# EAGLE design z80sim_pio_3_route_b (EAGLE 9.6.2)

## Sheet 1 of 2
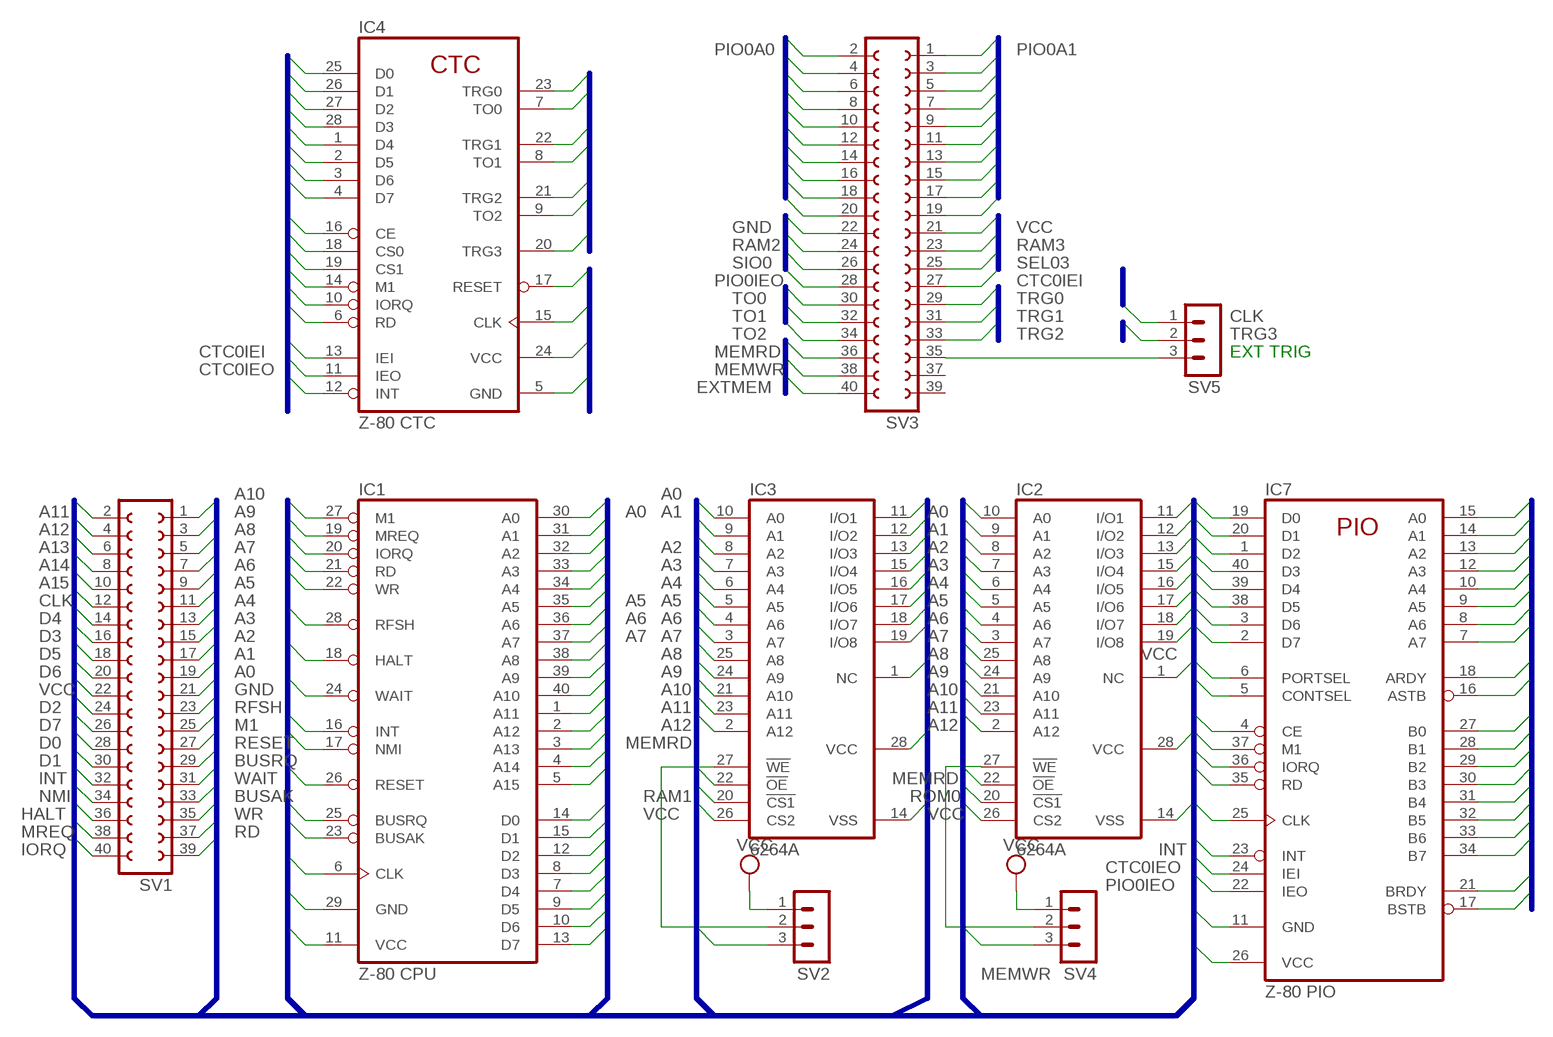
[diagram p0: schematic, sheet 1]

### Parts
IC1  Z-80 CPU  Z80CPU  [DIL40]
IC2  6264A  [DIL28-6]
IC3  6264A  [DIL28-6]
IC4  Z-80 CTC  Z80CTC  [DIL28]
IC7  Z-80 PIO  Z80PIO  [DIL40]
SV1  FE20-2  [FE20-2]
SV2  MA03-1  [MA03-1]
SV3  FE20-2  [FE20-2]
SV4  MA03-1  [MA03-1]
SV5  MA03-1  [MA03-1]

### Nets
A0: IC1.30(A0) IC2.10(A0) IC3.10(A0) IC4.18(CS0) IC7.6(PORTSEL) SV1.21
A1: IC1.31(A1) IC2.9(A1) IC3.9(A1) IC4.19(CS1) IC7.5(CONTSEL) SV1.19
A2: IC1.32(A2) IC2.8(A2) IC3.8(A2) SV1.17
A3: IC1.33(A3) IC2.7(A3) IC3.7(A3) SV1.15
A4: IC1.34(A4) IC2.6(A4) IC3.6(A4) SV1.13
A5: IC1.35(A5) IC2.5(A5) IC3.5(A5) SV1.11 ; also sheet 2
A6: IC1.36(A6) IC2.4(A6) IC3.4(A6) SV1.9 ; also sheet 2
A7: IC1.37(A7) IC2.3(A7) IC3.3(A7) SV1.7 ; also sheet 2
A8: IC1.38(A8) IC2.25(A8) IC3.25(A8) SV1.5
A9: IC1.39(A9) IC2.24(A9) IC3.24(A9) SV1.3
A10: IC1.40(A10) IC2.21(A10) IC3.21(A10) SV1.1
A11: IC1.1(A11) IC2.23(A11) IC3.23(A11) SV1.2
A12: IC1.2(A12) IC2.2(A12) IC3.2(A12) SV1.4
A13: IC1.3(A13) SV1.6 ; also sheet 2
A14: IC1.4(A14) SV1.8 ; also sheet 2
A15: IC1.5(A15) SV1.10 ; also sheet 2
BUSAK: IC1.23(BUSAK) SV1.35
BUSRQ: IC1.25(BUSRQ) SV1.31 ; also sheet 2
CLK: IC1.6(CLK) IC4.15(CLK) IC7.25(CLK) SV1.12 SV5.1 ; also sheet 2
CTC0: IC4.16(CE) ; also sheet 2
CTC0IEI: IC4.13(IEI) SV3.27 ; also sheet 2
CTC0IEO: IC4.11(IEO) IC7.24(IEI)
D0: IC1.14(D0) IC2.11(I/O1) IC3.11(I/O1) IC4.25(D0) IC7.19(D0) SV1.28
D1: IC1.15(D1) IC2.12(I/O2) IC3.12(I/O2) IC4.26(D1) IC7.20(D1) SV1.30
D2: IC1.12(D2) IC2.13(I/O3) IC3.13(I/O3) IC4.27(D2) IC7.1(D2) SV1.24
D3: IC1.8(D3) IC2.15(I/O4) IC3.15(I/O4) IC4.28(D3) IC7.40(D3) SV1.16
D4: IC1.7(D4) IC2.16(I/O5) IC3.16(I/O5) IC4.1(D4) IC7.39(D4) SV1.14
D5: IC1.9(D5) IC2.17(I/O6) IC3.17(I/O6) IC4.2(D5) IC7.38(D5) SV1.18
D6: IC1.10(D6) IC2.18(I/O7) IC3.18(I/O7) IC4.3(D6) IC7.3(D6) SV1.20
D7: IC1.13(D7) IC2.19(I/O8) IC3.19(I/O8) IC4.4(D7) IC7.2(D7) SV1.26
EXTMEM: SV3.40 ; also sheet 2
GND: IC1.29(GND) IC2.14(VSS) IC3.14(VSS) IC4.5(GND) IC7.11(GND) SV1.23 SV3.22 ; also sheet 2
HALT: IC1.18(HALT) SV1.36
INT: IC1.16(INT) IC4.12(INT) IC7.23(INT) SV1.32 ; also sheet 2
IORQ: IC1.20(IORQ) IC4.10(IORQ) IC7.36(IORQ) SV1.40 ; also sheet 2
M1: IC1.27(M1) IC4.14(M1) IC7.37(M1) SV1.27
MEMRD: IC2.22(!OE) IC3.22(!OE) SV3.36 ; also sheet 2
MEMWR: SV2.3 SV3.38 SV4.3 ; also sheet 2
MREQ: IC1.19(MREQ) SV1.38 ; also sheet 2
N$3: IC2.27(!WE) SV4.2
N$4: SV3.35 SV5.3
N$5: IC3.27(!WE) SV2.2
NMI: IC1.17(NMI) SV1.34 ; also sheet 2
PIO0: IC7.4(CE) ; also sheet 2
PIO0A0: IC7.15(A0) SV3.2
PIO0A1: IC7.14(A1) SV3.1
PIO0A2: IC7.13(A2) SV3.4
PIO0A3: IC7.12(A3) SV3.3
PIO0A4: IC7.10(A4) SV3.6
PIO0A5: IC7.9(A5) SV3.5
PIO0A6: IC7.8(A6) SV3.8
PIO0A7: IC7.7(A7) SV3.7
PIO0ARDY: IC7.18(ARDY) SV3.10
PIO0ASTB: IC7.16(ASTB) SV3.9
PIO0B0: IC7.27(B0) SV3.12
PIO0B1: IC7.28(B1) SV3.11
PIO0B2: IC7.29(B2) SV3.14
PIO0B3: IC7.30(B3) SV3.13
PIO0B4: IC7.31(B4) SV3.16
PIO0B5: IC7.32(B5) SV3.15
PIO0B6: IC7.33(B6) SV3.18
PIO0B7: IC7.34(B7) SV3.17
PIO0BRDY: IC7.21(BRDY) SV3.20
PIO0BSTB: IC7.17(BSTB) SV3.19
PIO0IEO: IC7.22(IEO) SV3.28
RAM1: IC3.20(!CS1) ; also sheet 2
RAM2: SV3.24 ; also sheet 2
RAM3: SV3.23 ; also sheet 2
RD: IC1.21(RD) IC4.6(RD) IC7.35(RD) SV1.39 ; also sheet 2
RESET: IC1.26(RESET) IC4.17(RESET) SV1.29 ; also sheet 2
RFSH: IC1.28(RFSH) SV1.25
ROM0: IC2.20(!CS1) ; also sheet 2
SEL03: SV3.25 ; also sheet 2
SIO0: SV3.26 ; also sheet 2
TO0: IC4.7(TO0) SV3.30
TO1: IC4.8(TO1) SV3.32
TO2: IC4.9(TO2) SV3.34
TRG0: IC4.23(TRG0) SV3.29
TRG1: IC4.22(TRG1) SV3.31
TRG2: IC4.21(TRG2) SV3.33
TRG3: IC4.20(TRG3) SV5.2
VCC: IC1.11(VCC) IC2.1(NC) IC2.26(CS2) IC2.28(VCC) IC3.1(NC) IC3.26(CS2) IC3.28(VCC) IC4.24(VCC) IC7.26(VCC) SV1.22 SV2.1 SV3.21 SV4.1 ; also sheet 2
WAIT: IC1.24(WAIT) SV1.33 ; also sheet 2
WR: IC1.22(WR) SV1.37 ; also sheet 2
Unconnected: SV3.37 SV3.39

### Buses
M1,MREQ,IORQ,RD,WR,RFSH,HALT,WAIT,INT,NMI,RESET,BUSRQ,BUSAK,CLK,GND,VCC,A[0..15],D[0..7],MEMRD,MEMWR,IORD,IOWR,ROM0,RAM1,RAM2,RAM3,PIO0,CTC0,CTC0IEO,PIO0IEO,SIO0,SIO0IEO,SEL03
PIO0A0,PIO0A1,PIO0A2,PIO0A3,PIO0A4,PIO0A5,PIO0A6,PIO0A7,PIO0B0,PIO0B1,PIO0B2,PIO0B3,PIO0B4,PIO0B5,PIO0B6,PIO0B7,PIO0ARDY,PIO0ASTB,PIO0BRDY,PIO0BSTB,PIO0ARDY,PIO0ASTB,PIO0BRDY,PIO0BSTB,CTC0TRG0,CTC0TO0,CTC0TRG1,CTC0TO1,CTC0TRG2,CTC0TO2,CTC0TRG3
M1,MREQ,IORQ,RD,WR,RFSH,HALT,WAIT,INT,NMI,RESET,BUSRQ,BUSAK,CLK,GND,VCC,A[0..15],D[0..7],MEMRD,MEMWR,IORD,IOWR,ROM0,RAM1,RAM2,RAM3,PIO0,CTC0,CTC0IEO,CTC0IEI,PIO0IEO,SIO0,SEL03,EXTMEM
TRG0,TO0,TRG1,TO1,TRG2,TO2,TRG3

### Notes on the sheet
- EXT TRIG

## Sheet 2 of 2
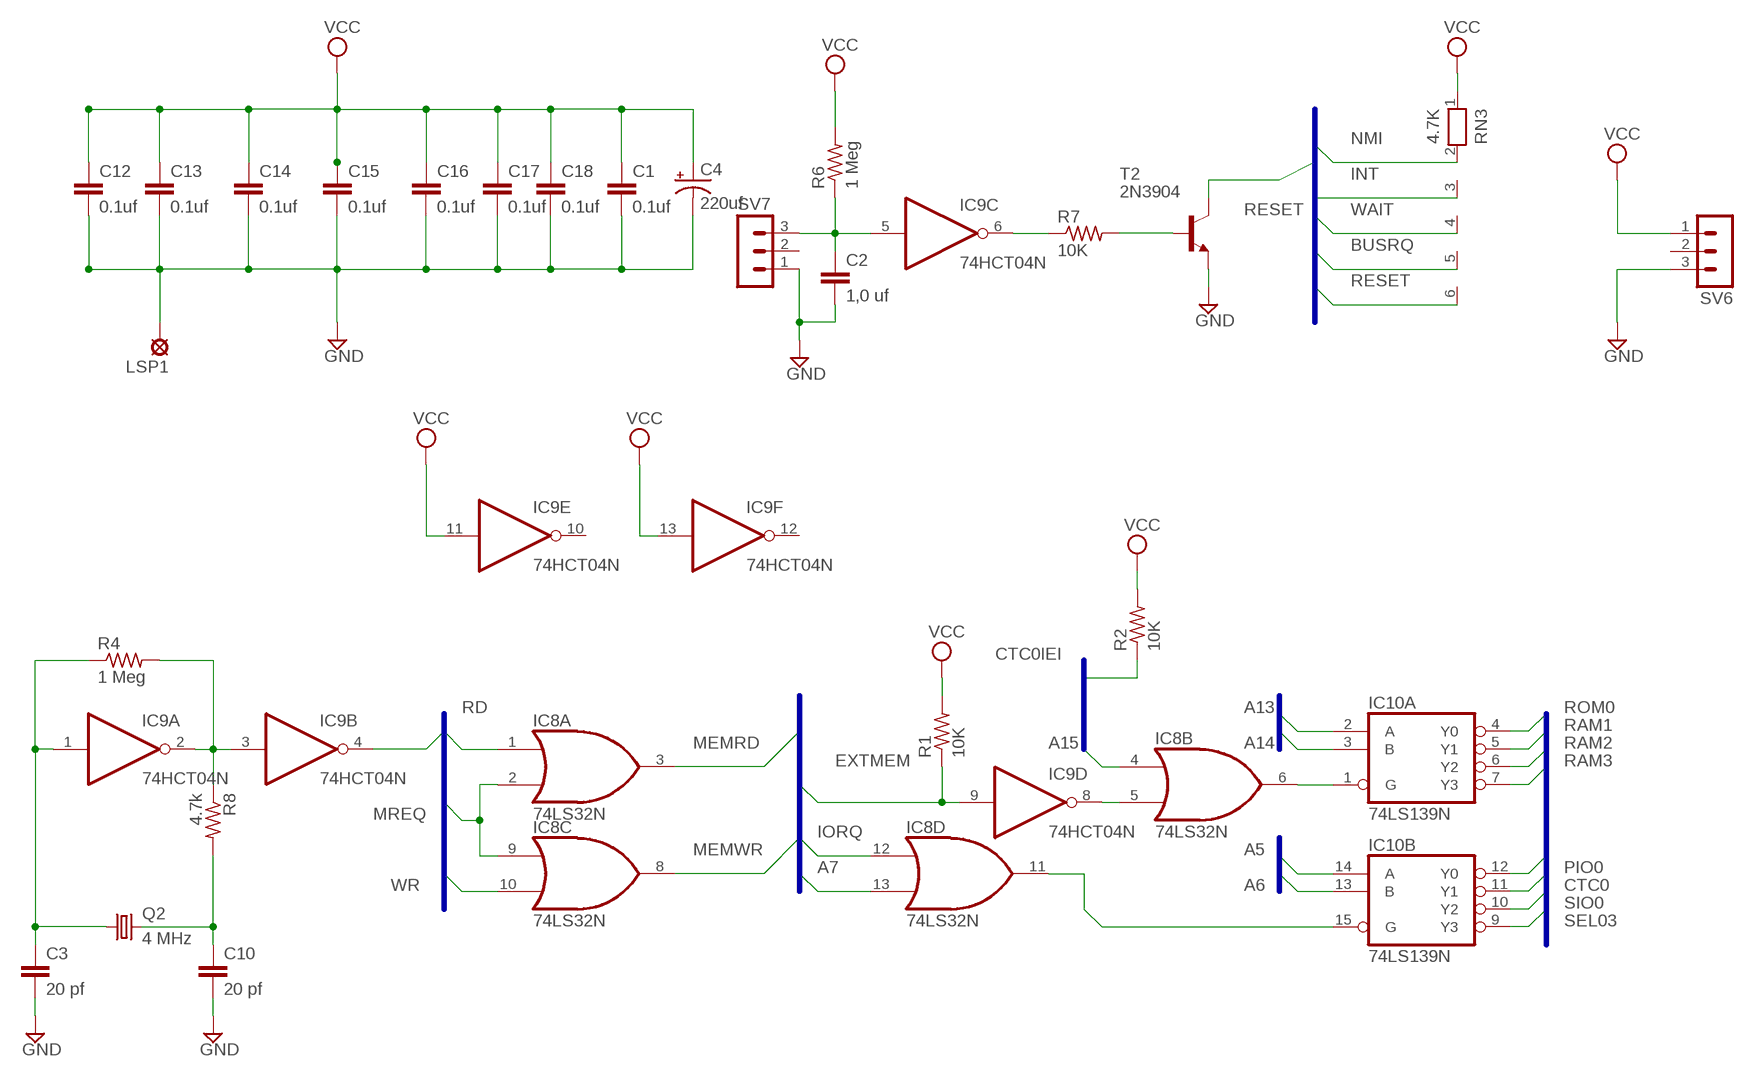
[diagram p1: schematic, sheet 2]

### Parts
C1  0.1uf  C5/3  [C5B3]
C2  1,0 uf  C5/3  [C5B3]
C3  20 pf  C2.5/5  [C2.5-5]
C4  220uf  CPOL-USE3.5-10  [E3,5-10]
C10  20 pf  C2.5/5  [C2.5-5]
C12  0.1uf  C5/3  [C5B3]
C13  0.1uf  C5/3  [C5B3]
C14  0.1uf  C5/3  [C5B3]
C15  0.1uf  C5/3  [C5B3]
C16  0.1uf  C5/3  [C5B3]
C17  0.1uf  C5/3  [C5B3]
C18  0.1uf  C5/3  [C5B3]
IC8  74LS32N  [DIL14]
IC9  74HCT04N  [DIL14]
IC10  74LS139N  [DIL16]
LSP1  LSP13  [LSP13]
Q2  4 MHz  CRYSTALHC49S  [HC49/S]
R1  10K  R-US_0204/7  [0204/7]
R2  10K  R-US_0204/7  [0204/7]
R4  1 Meg  R-US_0204/7  [0204/7]
R6  1 Meg  R-US_0204/7  [0204/7]
R7  10K  R-US_0204/7  [0204/7]
R8  4.7k  R-US_0204/7  [0204/7]
RN3  4.7K  RN05  [RN-6]
SV6  MA03-1  [MA03-1]
SV7  MA03-1  [MA03-1]
T2  2N3904  [TO92]

### Nets
A5: IC10.14(B:A) ; also sheet 1
A6: IC10.13(B:B) ; also sheet 1
A7: IC8.13(D:I1) ; also sheet 1
A13: IC10.2(A:A) ; also sheet 1
A14: IC10.3(A:B) ; also sheet 1
A15: IC8.4(B:I0) ; also sheet 1
BUSRQ: RN3.5 ; also sheet 1
CLK: IC9.4(B:O) ; also sheet 1
CTC0: IC10.11(B:Y1) ; also sheet 1
CTC0IEI: R2.1 ; also sheet 1
EXTMEM: IC9.9(D:I) R1.1 ; also sheet 1
GND: C1.2 C2.2 C3.2 C4.- C10.2 C12.2 C13.2 C14.2 C15.2 C16.2 C17.2 C18.2 LSP1.MP SV6.3 SV7.1 T2.3(E) ; also sheet 1
INT: RN3.2 ; also sheet 1
IORQ: IC8.12(D:I0) ; also sheet 1
MEMRD: IC8.3(A:O) ; also sheet 1
MEMWR: IC8.8(C:O) ; also sheet 1
MREQ: IC8.2(A:I1) IC8.9(C:I0) ; also sheet 1
N$1: IC8.6(B:O) IC10.1(A:G)
N$2: IC8.5(B:I1) IC9.8(D:O)
N$6: C10.1 Q2.2 R8.2
N$7: C3.1 IC9.1(A:I) Q2.1 R4.1
N$8: IC9.2(A:O) IC9.3(B:I) R4.2 R8.1
N$9: IC9.6(C:O) R7.1
N$10: C2.1 IC9.5(C:I) R6.1 SV7.3
N$11: R7.2 T2.2(B)
N$13: IC8.11(D:O) IC10.15(B:G)
NMI: RN3.3 ; also sheet 1
PIO0: IC10.12(B:Y0) ; also sheet 1
RAM1: IC10.5(A:Y1) ; also sheet 1
RAM2: IC10.6(A:Y2) ; also sheet 1
RAM3: IC10.7(A:Y3) ; also sheet 1
RD: IC8.1(A:I0) ; also sheet 1
RESET: RN3.6 T2.1(C) ; also sheet 1
ROM0: IC10.4(A:Y0) ; also sheet 1
SEL03: IC10.9(B:Y3) ; also sheet 1
SIO0: IC10.10(B:Y2) ; also sheet 1
VCC: C1.1 C4.+ C12.1 C13.1 C14.1 C15.1 C16.1 C17.1 C18.1 IC9.11(E:I) IC9.13(F:I) R1.2 R2.2 R6.2 RN3.1 SV6.1 ; also sheet 1
WAIT: RN3.4 ; also sheet 1
WR: IC8.10(C:I1) ; also sheet 1
Unconnected: IC9.10(E:O) IC9.12(F:O) SV6.2 SV7.2

### Buses
M1,MREQ,IORQ,RD,WR,RFSH,HALT,WAIT,INT,NMI,RESET,BUSRQ,BUSAK,CLK,GND,VCC,A[0..15],D[0..7],MEMRD,MEMWR,IORD,IOWR,ROM0,RAM1,RAM2,RAM3,PIO0,CTC0,CTC0IEO,PIO0IEO,SIO0,SIO0IEO,SEL03,EXTMEM
M1,MREQ,IORQ,RD,WR,RFSH,HALT,WAIT,INT,NMI,RESET,BUSRQ,BUSAK,CLK,GND,VCC,A[0..15],D[0..7],MEMRD,MEMWR,IORD,IOWR,ROM0,RAM1,RAM2,RAM3,PIO0,CTC0,CTC0IEO,CTC0IEI,PIO0IEO,SIO0,SEL03,EXTMEM

## Power pins joined to a net without a drawn wire
GND: IC8.7(P:GND) IC9.7(P:GND) IC10.8(P:GND)
VCC: IC8.14(P:VCC) IC9.14(P:VCC) IC10.16(P:VCC)

## Library data of the parts
C1-C3 C10 C12-C18 = capacitor-wima:C: CAPACITOR naming: grid - package width
C4 = rcl:CPOL-US: POLARIZED CAPACITOR, American symbol
IC1 = zilog:Z80CPU: Z80 FAMILY DEVICE
IC2 IC3 = memory-hitachi:6264A: MEMORY; OC_FARNELL: 283605; OC_NEWARK: unknown
IC4 = zilog:Z80CTC: Z80 FAMILY DEVICE
IC7 = zilog:Z80PIO: Z80 FAMILY DEVICE
IC8 = 74xx-us:74*32: Quad 2-input OR gate
IC9 = 74xx-eu:74*04: Hex INVERTER
IC10 = 74xx-us:74*139: Dual 2-line to 4-line DECODER/DEMULTIPLEXER
LSP1 = solpad:LSP13: SOLDER PAD drill 1.3 mm, distributor Buerklin, 12H562
Q2 = crystal:CRYSTAL: CRYSTAL; OC_FARNELL: 1667008; OC_NEWARK: unknown
R1 R2 R4 R6-R8 = resistor:R-US_: RESISTOR, American symbol
RN3 = resistor-net:RN05: RESISTOR NETWORK; OC_FARNELL: unknown; OC_NEWARK: unknown
SV1 SV3 = con-lsta:FE20-2: FEMALE HEADER; OC_FARNELL: unknown; OC_NEWARK: unknown
SV2 SV4-SV7 = con-lstb:MA03-1: PIN HEADER; OC_FARNELL: unknown; OC_NEWARK: unknown
T2 = transistor:2N3904: NPN TRANSISTOR

## Board
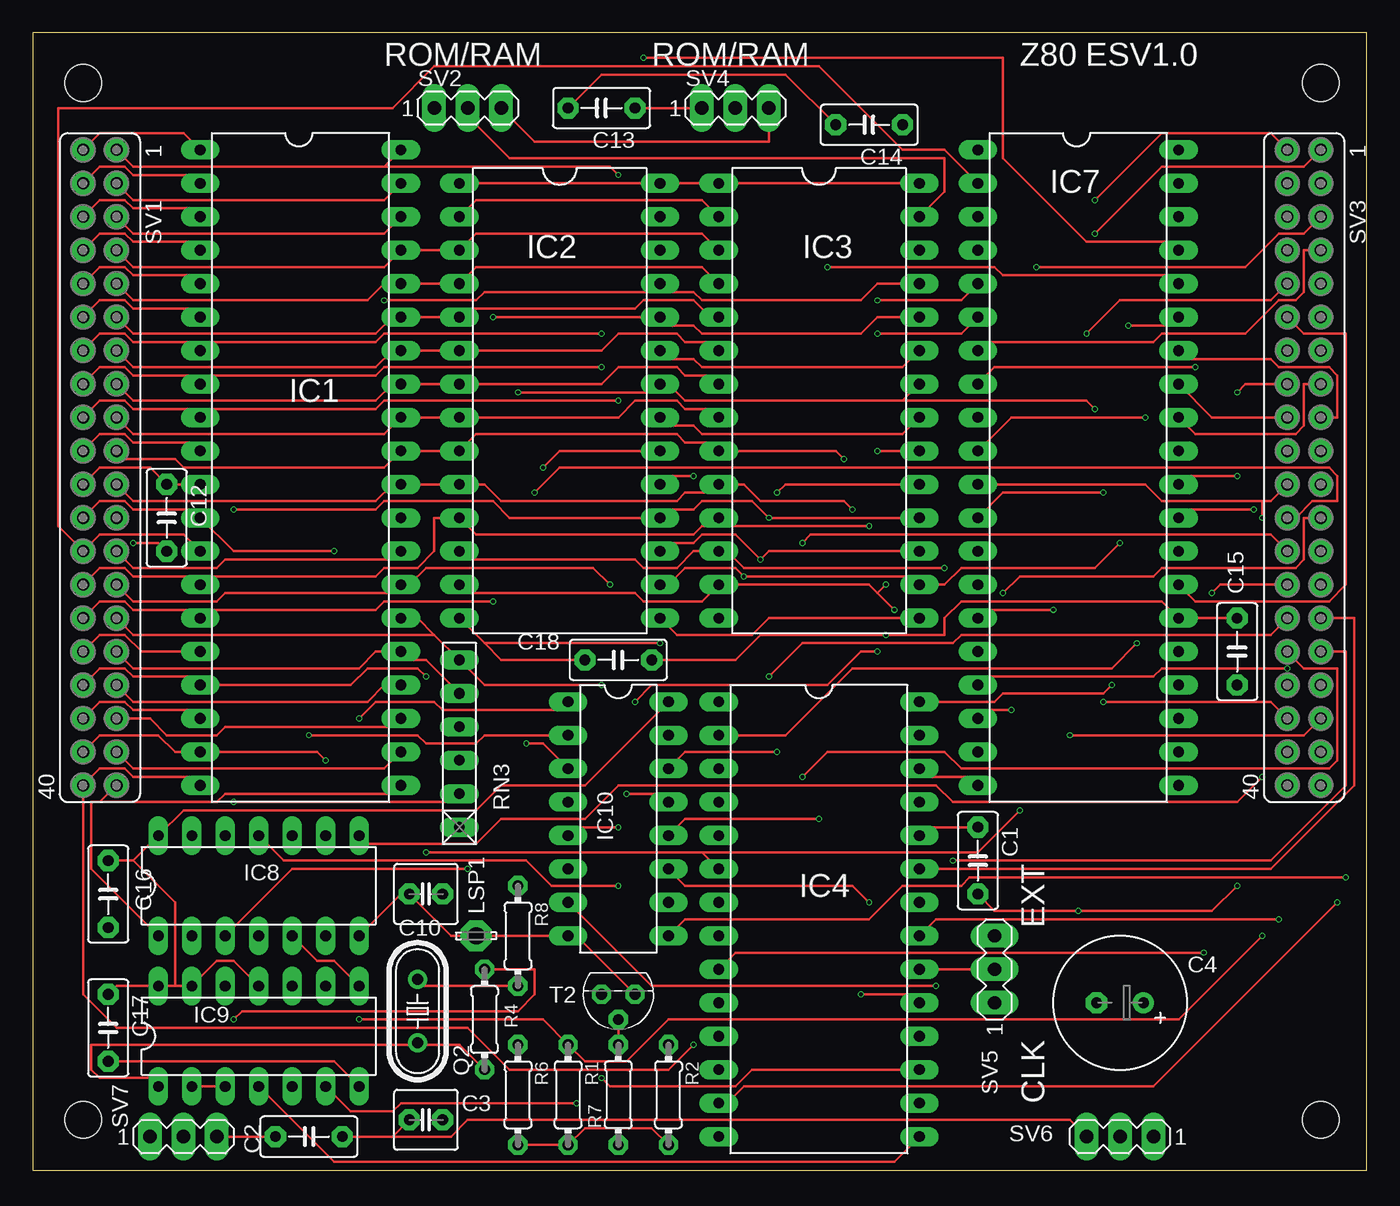
[diagram p2: board, top side]
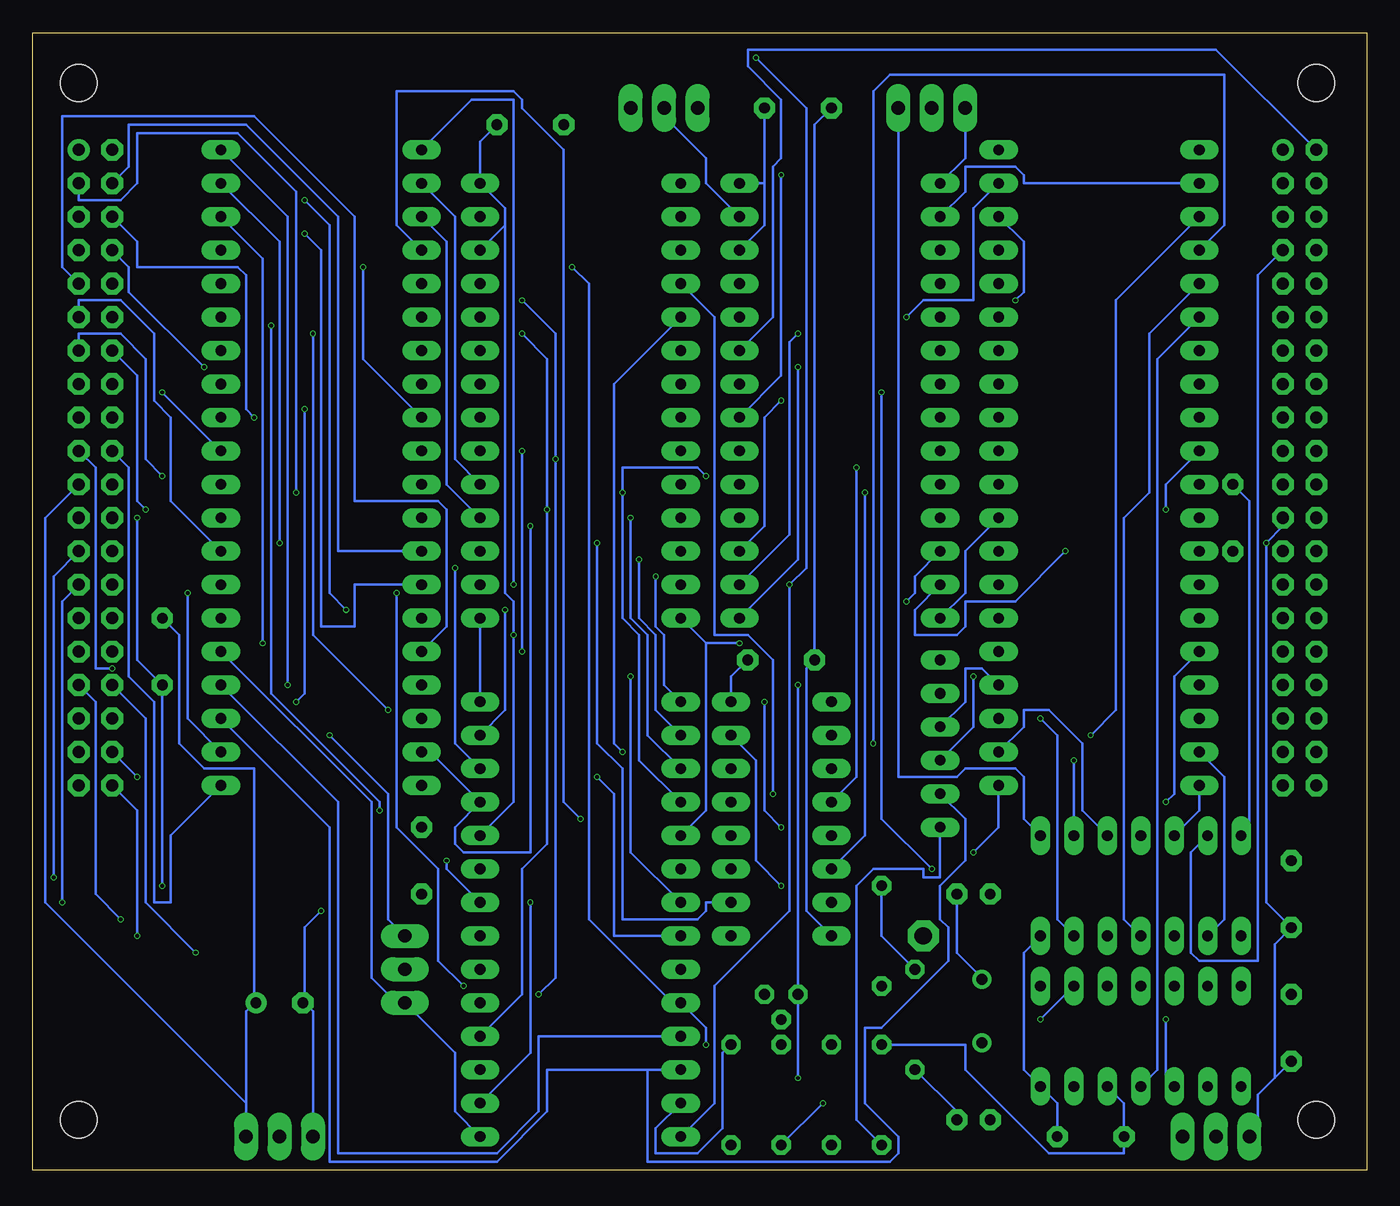
[diagram p3: board, bottom side, seen from below]

Size 101.27 x 86.35 mm. Coordinates in mm from the lower left corner, seen from the top.
Outline: 0,0 101.27,0 101.27,86.35 0,86.35 0,0
Copper layers (1*16): Top 0.035mm / dielectric 1.6mm / Bottom 0.035mm
Design rules "jlcpcb-2layers *": minimum track width 8mil, minimum drill 0.3mm, track to track 8mil, track to pad 8mil, pad to pad 8mil, via to via 8mil, smd to smd 5mil, copper to edge 0.2mm, drill to drill 8mil, minimum pad ring 10mil, minimum via ring 3mil, stop-mask expansion 4mil, vias tented up to drill 0mil, thermal gap 10mil
Holes 2.8 mm at 3.81,82.55 97.79,82.55 97.79,3.81 3.81,3.81

### Footprints (pad centres in the part's own frame; a part is rotated, then mirrored left to right if it is on the bottom)
C5B3 = drill 0.813 pad 1.6 octagon: 1 -2.54,0; 2 2.54,0
C2.5-5 = drill 0.813 pad 1.6 octagon: 1 -1.27,0; 2 1.27,0
E3,5-10 = drill 0.813 pad 1.6: + -1.778,0 | drill 0.813 pad 1.6 octagon: - 1.778,0
DIL40 = drill 0.813 long: 1 -24.13,-7.62; 2 -21.59,-7.62; 3 -19.05,-7.62; 4 -16.51,-7.62; 5 -13.97,-7.62; 6 -11.43,-7.62; 7 -8.89,-7.62; 8 -6.35,-7.62; 9 -3.81,-7.62; 10 -1.27,-7.62; 11 1.27,-7.62; 12 3.81,-7.62; 13 6.35,-7.62; 14 8.89,-7.62; 15 11.43,-7.62; 16 13.97,-7.62; 17 16.51,-7.62; 18 19.05,-7.62; 19 21.59,-7.62; 20 24.13,-7.62; 21 24.13,7.62; 22 21.59,7.62; 23 19.05,7.62; 24 16.51,7.62; 25 13.97,7.62; 26 11.43,7.62; 27 8.89,7.62; 28 6.35,7.62; 29 3.81,7.62; 30 1.27,7.62; 31 -1.27,7.62; 32 -3.81,7.62; 33 -6.35,7.62; 34 -8.89,7.62; 35 -11.43,7.62; 36 -13.97,7.62; 37 -16.51,7.62; 38 -19.05,7.62; 39 -21.59,7.62; 40 -24.13,7.62
DIL28-6 = drill 0.813 long: 1 -16.51,-7.62; 2 -13.97,-7.62; 3 -11.43,-7.62; 4 -8.89,-7.62; 5 -6.35,-7.62; 6 -3.81,-7.62; 7 -1.27,-7.62; 8 1.27,-7.62; 9 3.81,-7.62; 10 6.35,-7.62; 11 8.89,-7.62; 12 11.43,-7.62; 13 13.97,-7.62; 14 16.51,-7.62; 15 16.51,7.62; 16 13.97,7.62; 17 11.43,7.62; 18 8.89,7.62; 19 6.35,7.62; 20 3.81,7.62; 21 1.27,7.62; 22 -1.27,7.62; 23 -3.81,7.62; 24 -6.35,7.62; 25 -8.89,7.62; 26 -11.43,7.62; 27 -13.97,7.62; 28 -16.51,7.62
DIL28 = drill 0.813 long: 1 -16.51,-7.62; 2 -13.97,-7.62; 3 -11.43,-7.62; 4 -8.89,-7.62; 5 -6.35,-7.62; 6 -3.81,-7.62; 7 -1.27,-7.62; 8 1.27,-7.62; 9 3.81,-7.62; 10 6.35,-7.62; 11 8.89,-7.62; 12 11.43,-7.62; 13 13.97,-7.62; 14 16.51,-7.62; 15 16.51,7.62; 16 13.97,7.62; 17 11.43,7.62; 18 8.89,7.62; 19 6.35,7.62; 20 3.81,7.62; 21 1.27,7.62; 22 -1.27,7.62; 23 -3.81,7.62; 24 -6.35,7.62; 25 -8.89,7.62; 26 -11.43,7.62; 27 -13.97,7.62; 28 -16.51,7.62
DIL14 = drill 0.813 long: 1 -7.62,-3.81; 2 -5.08,-3.81; 3 -2.54,-3.81; 4 0,-3.81; 5 2.54,-3.81; 6 5.08,-3.81; 7 7.62,-3.81; 8 7.62,3.81; 9 5.08,3.81; 10 2.54,3.81; 11 0,3.81; 12 -2.54,3.81; 13 -5.08,3.81; 14 -7.62,3.81
DIL16 = drill 0.813 long: 1 -8.89,-3.81; 2 -6.35,-3.81; 3 -3.81,-3.81; 4 -1.27,-3.81; 5 1.27,-3.81; 6 3.81,-3.81; 7 6.35,-3.81; 8 8.89,-3.81; 9 8.89,3.81; 10 6.35,3.81; 11 3.81,3.81; 12 1.27,3.81; 13 -1.27,3.81; 14 -3.81,3.81; 15 -6.35,3.81; 16 -8.89,3.81
LSP13 = drill 1.321 pad 2.159 octagon: MP 0,0
HC49/S = drill 0.813: 1 -2.413,0; 2 2.413,0
0204/7 = drill 0.813 octagon: 1 -3.81,0; 2 3.81,0
RN-6 = drill 0.813 long: 1 -6.35,0; 2 -3.81,0; 3 -1.27,0; 4 1.27,0; 5 3.81,0; 6 6.35,0
FE20-2 = drill 0.914: 1 -24.13,1.27 | drill 0.914 octagon: 2 -24.13,-1.27; 3 -21.59,1.27; 4 -21.59,-1.27; 5 -19.05,1.27; 6 -19.05,-1.27; 7 -16.51,1.27; 8 -16.51,-1.27; 9 -13.97,1.27; 10 -13.97,-1.27; 11 -11.43,1.27; 12 -11.43,-1.27; 13 -8.89,1.27; 14 -8.89,-1.27; 15 -6.35,1.27; 16 -6.35,-1.27; 17 -3.81,1.27; 18 -3.81,-1.27; 19 -1.27,1.27; 20 -1.27,-1.27; 21 1.27,1.27; 22 1.27,-1.27; 23 3.81,1.27; 24 3.81,-1.27; 25 6.35,1.27; 26 6.35,-1.27; 27 8.89,1.27; 28 8.89,-1.27; 29 11.43,1.27; 30 11.43,-1.27; 31 13.97,1.27; 32 13.97,-1.27; 33 16.51,1.27; 34 16.51,-1.27; 35 19.05,1.27; 36 19.05,-1.27; 37 21.59,1.27; 38 21.59,-1.27; 39 24.13,1.27; 40 24.13,-1.27
MA03-1 = drill 1.016 long: 1 -2.54,0; 2 0,0; 3 2.54,0
TO92 = drill 0.813 octagon: 1 1.27,0; 2 0,1.905; 3 -1.27,0

### Placement (x,y rotation side)
C1  71.75,23.5 270 top
C2  20.95,2.54 0 top
C3  29.84,3.81 180 top
C4  82.55,12.7 180 top
C10  29.84,20.95 180 top
C12  10.16,49.53 270 top
C13  43.18,80.64 180 top
C14  63.5,79.38 180 top
C15  91.44,39.37 270 top
C16  5.71,20.95 270 top
C17  5.71,10.79 270 top
C18  44.45,38.73 180 top
IC1  20.32,53.34 270 top
IC2  40.01,58.42 270 top
IC3  59.69,58.42 270 top
IC4  59.69,19.05 270 top
IC7  79.38,53.34 270 top
IC8  17.14,21.59 0 top
IC9  17.14,10.16 0 top
IC10  44.45,26.67 270 top
LSP1  33.66,17.78 0 top
Q2  29.21,12.06 90 top
R1  40.64,5.71 270 top
R2  48.26,5.71 270 top
R4  34.29,11.43 90 top
R6  36.83,5.71 270 top
R7  44.45,5.71 90 top
R8  36.83,17.78 270 top
RN3  32.38,32.38 90 top
SV1  5.08,53.34 270 top
SV2  33.02,80.64 0 top
SV3  96.52,53.34 270 top
SV4  53.34,80.64 0 top
SV5  73.03,15.24 90 top
SV6  82.55,2.54 180 top
SV7  11.43,2.54 0 top
T2  44.45,13.34 180 top

### Tracks (layer width: path | path; a pad name or v marks a point on that pad's centre or on a via)
A0  (via drill 0.3)
  Top 0.203: v62.23,50.16 61.59,50.8 55.24,50.8 53.98,52.07 IC3.10 51.44,51.44 49.53,51.44 48.9,50.8 35.56,50.8 34.29,52.07 IC2.10 IC1.30 27.3,52.07 26.04,50.8 7.62,50.8 SV1.21 | IC7.6 70.48,63.5 v64.14,63.5
  Bottom 0.203: IC4.18 64.14,13.34 64.14,22.86 62.23,24.77 v62.23,50.16 62.23,61.59 v64.14,63.5
A1  (via drill 0.3)
  Top 0.203: IC4.19 66.67,13.34 v62.87,13.34 | v61.59,53.98 60.96,54.61 IC3.9 51.44,55.24 49.53,55.24 48.9,55.88 33.66,55.88 IC2.9 IC1.31 26.67,53.34 11.43,53.34 10.79,53.98 6.99,53.98 SV1.19 | IC7.5 70.48,66.04 v64.14,66.04
  Bottom 0.203: v62.87,13.34 61.59,14.61 v61.59,53.98 61.59,63.5 v64.14,66.04
A2
  Top 0.203: IC3.8 51.44,57.78 49.53,57.78 48.9,58.42 45.72,58.42 44.45,57.15 IC2.8 IC1.32 26.67,55.88 7.62,55.88 SV1.17
A3
  Top 0.203: IC3.7 51.44,60.33 49.53,60.33 48.9,60.96 44.45,60.96 43.18,59.69 IC2.7 IC1.33 27.3,59.69 26.04,58.42 7.62,58.42 SV1.15
A4
  Top 0.203: IC3.6 51.44,62.87 49.53,62.87 48.9,63.5 44.45,63.5 43.18,62.23 IC2.6 IC1.34 27.3,62.23 26.04,60.96 7.62,60.96 SV1.13
A5  (via drill 0.3)
  Top 0.203: SV1.11 7.62,63.5 26.04,63.5 27.3,64.77 IC1.35 IC2.5 33.02,65.41 45.72,65.41 46.35,66.04 50.16,66.04 51.44,64.77 IC3.5 | IC10.14 49.53,31.75 v56.52,31.75
  Bottom 0.203: v56.52,31.75 57.15,32.38 57.15,59.69 IC3.5
A6  (via drill 0.3)
  Top 0.203: SV1.9 7.62,66.04 25.4,66.04 26.67,67.31 IC1.36 IC2.4 33.66,68.58 50.8,68.58 IC3.4 | IC10.13 47.62,28.57 v45.09,28.57
  Bottom 0.203: v45.09,28.57 45.09,38.73 46.99,40.64 49.53,40.64 49.53,64.77 IC3.4
A7
  Top 0.203: IC3.3 50.8,71.12 33.66,71.12 IC2.3 IC1.37 26.67,68.58 7.62,68.58 SV1.7
  Bottom 0.203: IC8.13 13.34,24.13 13.34,16.51 12.7,15.88 8.26,15.88 8.26,67.94 SV1.7
A8  (via drill 0.3)
  Top 0.203: IC3.25 64.14,67.31 62.87,66.04 50.8,66.04 50.16,66.67 48.26,66.67 IC2.25 46.99,66.67 34.29,66.67 33.66,66.04 v26.67,66.04 | IC1.38 26.67,71.12 7.62,71.12 SV1.5
  Bottom 0.203: v26.67,66.04 26.04,66.67 26.04,70.48 IC1.38
A9  (via drill 0.3)
  Top 0.203: IC3.24 64.14,64.77 62.87,63.5 50.8,63.5 50.16,64.14 48.26,64.14 IC2.24 v34.92,64.77 | IC1.39 26.67,73.66 7.62,73.66 SV1.3
  Bottom 0.203: v34.92,64.77 33.66,66.04 29.84,66.04 29.84,73.03 IC1.39
A10  (via drill 0.3)
  Top 0.203: IC2.21 48.26,56.52 50.16,56.52 50.8,55.88 66.04,55.88 IC3.21 | 26.67,76.2 IC1.40 | 26.67,76.2 7.62,76.2 SV1.1 | v44.45,75.56 43.81,76.2 26.67,76.2
  Bottom 0.203: IC2.21 44.45,60.33 v44.45,75.56
A11
  Top 0.203: IC1.1 11.43,78.74 5.08,78.74 SV1.2 | IC2.23 48.26,61.59 50.16,61.59 50.8,60.96 66.04,60.96 IC3.23
  Bottom 0.203: SV1.2 11.43,85.09 46.99,85.09 46.99,83.82 44.45,81.28 44.45,76.83 45.09,76.2 45.09,64.77 IC2.23
A12
  Top 0.203: IC1.2 12.06,75.56 7.62,75.56 6.99,76.2 5.08,76.2 SV1.4 | IC2.2 33.66,73.66 50.8,73.66 IC3.2
  Bottom 0.203: IC1.2 26.04,74.93 26.04,75.56 26.67,76.2 30.48,76.2 30.48,74.3 IC2.2
A13  (via drill 0.3)
  Top 0.203: IC1.3 12.06,73.03 7.62,73.03 6.99,73.66 5.08,73.66 SV1.6 | IC10.2 34.29,33.02 33.66,32.38 29.84,32.38 29.21,33.02 v20.95,33.02
  Bottom 0.203: v20.95,33.02 19.05,34.92 19.05,66.04 IC1.3
A14  (via drill 0.3)
  Top 0.203: IC1.4 12.06,70.48 7.62,70.48 6.99,71.12 5.08,71.12 SV1.8 | IC10.3 38.73,32.38 v37.47,32.38
  Bottom 0.203: v37.47,32.38 37.47,81.92 36.2,83.19 10.79,83.19 10.79,71.75 IC1.4
A15
  Top 0.203: IC1.5 12.06,67.94 7.62,67.94 6.99,68.58 5.08,68.58 SV1.10
  Bottom 0.203: IC8.4 18.41,19.05 18.41,49.53 16.51,51.44 16.51,63.5 IC1.5
BUSAK
  Top 0.203: IC1.23 27.3,33.66 14.61,33.66 13.97,33.02 10.16,33.02 8.89,34.29 SV1.35
BUSRQ
  Top 0.203: RN3.5 29.84,38.73 28.57,38.73 IC1.25 26.04,39.37 24.77,38.1 7.62,38.1 SV1.31
CLK
  Top 0.203: IC1.6 12.06,65.41 7.62,65.41 6.99,66.04 5.08,66.04 SV1.12 | IC9.4 22.86,0.64 65.41,0.64 IC4.15
  Bottom 0.203: IC7.25 75.56,27.94 75.56,14.61 73.66,12.7 SV5.1 69.22,8.89 69.22,4.45 IC4.15 | IC1.6 15.88,61.59 15.88,7.62 IC9.4
CTC0  (via drill 0.3)
  Top 0.203: v63.5,20.32 62.23,21.59 49.53,21.59 IC10.11
  Bottom 0.203: IC4.16 63.5,8.89 v63.5,20.32
CTC0IEI  (via drill 0.3)
  Top 0.203: v99.06,20.32 85.09,6.35 53.98,6.35 52.7,5.08 IC4.13
  Bottom 0.203: R2.1 48.9,8.89 48.9,3.17 50.8,1.27 53.98,1.27 53.98,3.17 IC4.13 | SV3.27 99.06,43.18 v99.06,20.32
CTC0IEO
  Bottom 0.203: IC4.11 62.87,10.16 62.87,4.45 66.04,1.27 78.11,1.27 78.11,27.94 IC7.24
D0  (via drill 0.3)
  Top 0.203: SV1.28 5.08,45.72 6.99,45.72 7.62,45.09 12.06,45.09 IC1.14 13.34,45.09 26.04,45.09 26.67,45.72 29.21,45.72 30.48,46.99 30.48,49.53 IC2.11 33.66,48.26 50.16,48.26 50.8,48.9 | 50.8,48.9 51.44,49.53 IC3.11 | 50.8,48.9 v63.5,48.9
  Bottom 0.203: IC7.19 71.12,31.75 IC4.25 69.22,26.04 69.22,24.77 68.58,24.13 63.5,24.13 v63.5,48.9
D1  (via drill 0.3)
  Top 0.203: SV1.30 5.08,43.18 6.99,43.18 7.62,42.55 12.06,42.55 IC1.15 13.34,42.55 26.04,42.55 26.67,43.18 v34.92,43.18 | IC4.26 67.94,29.84 71.12,29.84 IC7.20 | IC2.12 33.02,46.35 45.72,46.35 46.35,45.72 48.9,45.72 50.16,46.99 IC3.12 52.7,46.99 53.98,45.72 v69.22,45.72
  Bottom 0.203: IC4.26 69.22,32.38 v69.22,45.72 | v34.92,43.18 34.29,43.81 34.29,45.09 IC2.12
D2  (via drill 0.3)
  Top 0.203: SV1.24 5.08,50.8 6.99,50.8 7.62,50.16 12.06,50.16 IC1.12 15.24,46.99 v22.86,46.99 | IC2.13 33.02,43.81 45.72,43.81 46.35,43.18 50.8,43.18 IC3.13 63.5,44.45 64.14,43.81 | 64.14,43.81 v65.41,42.55 | 64.14,43.81 v64.77,44.45
  Bottom 0.203: IC4.27 65.41,34.92 v65.41,42.55 | IC7.1 67.94,81.28 64.77,81.28 v64.77,44.45 | v22.86,46.99 26.67,43.18 30.48,43.18 30.48,41.27 31.11,40.64 34.29,40.64 34.29,42.55 IC2.13
D3  (via drill 0.3)
  Top 0.203: SV1.16 5.08,60.96 6.99,60.96 7.62,60.33 12.06,60.33 IC1.8 13.34,60.33 26.04,60.33 26.67,60.96 v43.18,60.96 | IC2.15 48.9,40.64 54.61,40.64 55.88,41.91 IC3.15 | v81.92,36.83 81.28,36.2 73.66,36.2 73.03,35.56 IC4.28
  Bottom 0.203: IC3.15 IC4.28 | IC7.40 81.92,72.39 v81.92,36.83 | v43.18,60.96 43.18,46.35 IC2.15
D4  (via drill 0.3)
  Top 0.203: SV1.14 5.08,63.5 6.99,63.5 7.62,62.87 12.06,62.87 IC1.7 13.34,62.87 26.04,62.87 26.67,63.5 v43.18,63.5 | IC2.16 48.26,44.45 49.53,45.72 53.34,45.72 v53.98,45.09 66.67,45.09 IC3.16 69.22,44.45 70.48,45.72 80.64,45.72 v82.55,47.62
  Bottom 0.203: IC4.1 53.34,36.83 53.34,40.64 53.98,41.27 v53.98,45.09 | IC7.39 82.55,70.48 v82.55,47.62 | v43.18,63.5 43.81,62.87 43.81,48.26 IC2.16
D5  (via drill 0.3)
  Top 0.203: SV1.18 5.08,58.42 6.99,58.42 7.62,57.78 12.06,57.78 IC1.9 13.34,57.78 26.04,57.78 26.67,58.42 v44.45,58.42 | IC3.17 55.88,46.99 v55.24,46.35 53.34,48.26 50.8,48.26 50.16,47.62 48.26,47.62 IC2.17 | v83.82,40.01 81.92,38.1 62.23,38.1 57.15,33.02 IC4.2
  Bottom 0.203: IC4.2 53.98,34.92 53.98,40.64 55.24,41.91 v55.24,46.35 | IC7.38 83.82,69.22 v83.82,40.01 | v44.45,58.42 45.72,57.15 45.72,48.9 IC2.17
D6  (via drill 0.3)
  Top 0.203: IC1.10 12.06,55.24 7.62,55.24 6.99,55.88 5.08,55.88 SV1.20 | IC3.18 v55.88,49.53 54.61,50.8 50.8,50.8 50.16,50.16 48.26,50.16 IC2.18 36.2,49.53 34.92,50.8 26.67,50.8 26.04,50.16 v15.24,50.16
  Bottom 0.203: IC4.3 54.61,33.02 54.61,40.64 55.88,41.91 v55.88,49.53 | IC7.3 69.85,70.48 69.85,52.07 IC3.18 | IC1.10 15.24,52.07 v15.24,50.16
D7  (via drill 0.3)
  Top 0.203: IC1.13 11.43,48.26 5.08,48.26 SV1.26 1.91,48.9 1.91,80.64 27.3,80.64 30.48,83.82 59.69,83.82 66.04,77.47 69.22,77.47 IC7.2 | v56.52,51.44 57.15,52.07 IC3.19 | IC2.19 48.26,52.7 v50.16,52.7
  Bottom 0.203: IC4.4 55.24,31.11 55.24,40.64 56.52,41.91 v56.52,51.44 56.52,53.34 50.8,53.34 v50.16,52.7 | IC7.2 69.22,72.39 69.22,53.98 IC3.19
EXTMEM  (via drill 0.3)
  Top 0.203: v24.77,11.43 38.73,11.43 R1.1 41.91,8.26 45.09,8.26 48.26,11.43 87,11.43 v93.34,17.78
  Bottom 0.203: v24.77,11.43 IC9.9 | SV3.40 93.34,27.3 v93.34,17.78
GND  (via drill 0.3)
  Top 0.203: C13.2 43.18,83.19 57.15,83.19 C14.2 | 34.29,40.01 35.56,38.73 C18.2 | 34.29,40.01 IC2.14 | 34.29,40.01 v47.62,40.01 | IC7.11 84.45,52.07 85.72,50.8 93.34,50.8 | 93.34,50.8 93.98,50.8 SV3.22 | 93.34,50.8 v93.34,49.53 | IC8.7 27.94,20.95 C10.2 31.75,17.78 LSP1.MP IC10.8 41.27,17.78 T2.3 | C1.2 73.03,19.68 v79.38,19.68 89.53,19.68 v91.44,21.59 | 27.3,2.54 C3.2 | C2.2 27.3,2.54 | C12.2 9.53,47.62 v7.62,47.62 | IC9.7 22.86,8.26 C17.2 | SV6.3 78.74,3.81 33.02,3.81 31.75,2.54 27.3,2.54
  Bottom 0.203: IC4.5 50.16,27.3 50.16,40.01 | IC3.14 50.16,40.01 | IC1.29 30.48,46.99 30.48,43.81 IC2.14 | v47.62,40.01 50.16,40.01 | C13.2 41.91,79.38 C18.2 42.55,38.1 42.55,19.68 IC10.8 | v93.34,49.53 93.34,38.73 C15.2 v91.44,21.59 | 80.64,12.7 80.01,12.06 SV6.3 | v79.38,19.68 80.64,18.41 80.64,12.7 | 80.64,12.7 C4.- | C2.2 23.5,5.08 IC9.7 26.04,7.62 26.04,16.51 IC8.7 | SV1.23 6.35,48.9 v7.62,47.62 7.62,20.32 C16.2 6.99,17.14 6.99,6.99 | 6.99,6.99 8.26,5.71 8.26,3.17 SV7.1 | 6.99,6.99 C17.2
HALT
  Top 0.203: IC1.18 12.06,34.92 7.62,34.92 6.99,35.56 5.08,35.56 SV1.36
INT  (via drill 0.3)
  Top 0.203: RN3.2 31.75,27.94 v15.24,27.94 | SV1.32 5.08,40.64 6.99,40.64 8.26,39.37 IC1.16
  Bottom 0.203: v15.24,27.94 14.61,28.57 14.61,37.47 IC1.16 | 54.61,7.62 62.23,7.62 62.23,4.45 66.04,0.64 78.74,0.64 78.74,26.04 IC7.23 | 54.61,7.62 IC4.12 | RN3.2 30.48,26.67 30.48,23.5 32.38,21.59 32.38,19.05 31.75,18.41 31.75,15.88 36.83,10.79 38.1,10.79 38.1,5.08 35.56,2.54 35.56,1.27 36.2,0.64 54.61,0.64 54.61,7.62
IORQ  (via drill 0.3)
  Top 0.203: v50.16,9.53 48.26,7.62 36.2,7.62 33.02,10.79 6.35,10.79 3.81,13.34 SV1.40 5.08,30.48 6.99,30.48 7.62,29.84 12.06,29.84 IC1.20 | IC7.36 86.36,67.94 73.66,67.94 73.03,68.58 v60.33,68.58
  Bottom 0.203: IC8.12 12.7,27.3 IC1.20 | v50.16,9.53 50.16,10.79 IC4.10 52.7,12.7 59.05,19.05 59.05,67.31 v60.33,68.58
M1  (via drill 0.3)
  Top 0.203: SV1.27 7.62,43.18 13.97,43.18 14.61,43.81 27.3,43.81 IC1.27 28.57,44.45 29.84,45.72 42.55,45.72 v43.81,44.45 | IC7.37 86.36,70.48 80.01,70.48 73.66,76.83 73.66,84.45 v46.35,84.45
  Bottom 0.203: IC4.14 49.53,5.08 49.53,13.97 43.81,19.68 v43.81,44.45 42.55,45.72 42.55,80.64 v46.35,84.45
MEMRD  (via drill 0.3)
  Top 0.203: IC8.3 19.68,22.86 v33.02,22.86 | v36.83,59.05 46.99,59.05 IC2.22 48.26,59.69 49.53,58.42 66.04,58.42 | 66.04,58.42 IC3.22 | SV3.36 93.98,35.56 v81.28,35.56 | v80.64,57.78 80.01,58.42 66.04,58.42
  Bottom 0.203: v33.02,22.86 36.83,26.67 v36.83,59.05 | v81.28,35.56 80.64,36.2 v80.64,57.78
MEMWR  (via drill 0.3)
  Top 0.203: v93.34,29.84 91.44,27.94 69.85,27.94 68.58,29.21 44.45,29.21 41.91,26.67 35.56,26.67 33.66,24.77 25.4,24.77 IC8.8 | SV4.3 55.88,78.11 38.1,78.11 SV2.3
  Bottom 0.203: IC8.8 26.04,26.67 26.04,29.84 26.67,30.48 30.48,30.48 31.11,29.84 35.56,29.84 SV2.3 | v93.34,29.84 SV3.38
MREQ  (via drill 0.3)
  Top 0.203: v22.23,31.11 21.59,31.75 IC1.19 10.79,31.75 9.53,33.02 5.08,33.02 SV1.38
  Bottom 0.203: IC8.2 10.79,19.05 10.79,29.84 IC1.19 | v22.23,31.11 IC8.9
N$1  (via drill 0.3)
  Top 0.203: v24.77,34.29 26.04,35.56 30.48,35.56 31.11,34.92 40.01,34.92 IC10.1
  Bottom 0.203: IC8.6 23.5,19.05 23.5,33.02 v24.77,34.29
N$2
  Top 0.203: IC8.5 21.59,15.88 22.86,15.88 IC9.8
N$3
  Bottom 0.203: IC2.27 50.16,74.93 50.16,76.83 53.34,80.01 SV4.2
N$4  (via drill 0.3)
  Top 0.203: SV3.35 96.52,33.02 v78.74,33.02
  Bottom 0.203: v78.74,33.02 74.3,28.57 74.3,19.05 SV5.3
N$5
  Top 0.203: IC3.27 69.22,74.3 69.22,76.83 36.2,76.83 33.02,80.01 SV2.2
N$6
  Top 0.203: R8.2 29.21,13.97 Q2.2
  Bottom 0.203: C10.1 31.11,16.51 29.21,14.61 Q2.2
N$7
  Top 0.203: IC9.1 8.89,6.99 5.08,6.99 4.45,7.62 4.45,9.53 29.21,9.53 | R4.1 32.38,9.53 29.21,9.53 | 29.21,9.53 Q2.1
  Bottom 0.203: R4.1 31.11,4.45 C3.1
N$8  (via drill 0.3)
  Top 0.203: IC9.3 IC9.2 | v15.24,11.43 15.88,12.06 36.83,12.06 38.1,13.34 38.1,15.24 R4.2
  Bottom 0.203: R4.2 36.83,17.78 R8.1 | IC9.3 15.24,6.99 v15.24,11.43
N$9  (via drill 0.3)
  Top 0.203: IC9.6 24.13,4.45 27.3,4.45 27.94,5.08 v41.27,5.08
  Bottom 0.203: R7.1 v41.27,5.08
N$10
  Top 0.203: C2.1 SV7.3
  Bottom 0.203: IC9.5 18.41,5.08 C2.1 18.41,1.27 24.13,1.27 30.48,7.62 30.48,9.53 R6.1
N$11
  Top 0.203: T2.2 R7.2
N$13  (via drill 0.3)
  Top 0.203: IC8.11 19.05,23.5 37.47,23.5 39.37,21.59 v44.45,21.59
  Bottom 0.203: v44.45,21.59 46.35,23.5 46.35,31.11 IC10.15
NMI  (via drill 0.3)
  Top 0.203: SV1.34 5.08,38.1 6.99,38.1 7.62,37.47 12.06,37.47 IC1.17 24.13,36.83 25.4,38.1 29.21,38.1 v29.84,37.47
  Bottom 0.203: RN3.3 29.84,33.66 v29.84,37.47
PIO0  (via drill 0.3)
  Top 0.203: IC10.12 49.53,26.67 v59.69,26.67
  Bottom 0.203: v59.69,26.67 60.96,27.94 60.96,77.47 64.14,80.64 64.14,81.28 64.77,81.92 73.66,81.92 73.66,71.75 IC7.4
PIO0A0  (via drill 0.3)
  Top 0.203: IC7.15 72.39,42.55 v77.47,42.55 | v80.64,73.66 85.72,78.74 93.98,78.74 SV3.2
  Bottom 0.203: v77.47,42.55 78.74,43.81 78.74,71.75 v80.64,73.66
PIO0A1  (via drill 0.3)
  Top 0.203: v80.64,71.12 85.72,76.2 96.52,76.2 SV3.1
  Bottom 0.203: IC7.14 76.83,44.45 76.83,41.27 79.38,41.27 79.38,69.85 v80.64,71.12
PIO0A2
  Bottom 0.203: IC7.13 78.11,46.99 78.11,72.39 85.09,79.38 93.98,79.38 93.98,76.2 SV3.4
PIO0A3  (via drill 0.3)
  Top 0.203: IC7.12 73.66,51.44 v81.28,51.44
  Bottom 0.203: v81.28,51.44 81.28,74.3 85.72,78.74 93.34,78.74 93.34,74.93 94.61,73.66 97.79,73.66 SV3.3
PIO0A4  (via drill 0.3)
  Top 0.203: IC7.10 74.3,57.15 v84.45,57.15
  Bottom 0.203: v84.45,57.15 85.09,57.78 85.09,67.94 85.72,68.58 93.34,68.58 93.34,70.48 SV3.6
PIO0A5  (via drill 0.3)
  Top 0.203: v76.2,68.58 92.08,68.58 94.61,71.12 96.52,71.12 SV3.5
  Bottom 0.203: IC7.9 76.2,61.59 v76.2,68.58
PIO0A6  (via drill 0.3)
  Top 0.203: IC7.8 73.03,60.96 v88.27,60.96
  Bottom 0.203: v88.27,60.96 93.98,66.67 93.98,68.58 SV3.8
PIO0A7
  Top 0.203: IC7.7 72.39,62.87 85.09,62.87 85.72,63.5 92.08,63.5 94.61,66.04 95.89,66.04 96.52,66.67 96.52,69.85 SV3.7
PIO0ARDY  (via drill 0.3)
  Top 0.203: IC7.18 72.39,34.92 v74.3,34.92 | v80.01,63.5 82.55,66.04 93.98,66.04 SV3.10
  Bottom 0.203: v74.3,34.92 80.01,40.64 v80.01,63.5
PIO0ASTB
  Bottom 0.203: IC7.16 69.85,41.27 69.85,50.16 70.48,50.8 76.83,50.8 76.83,72.39 84.45,80.01 99.06,80.01 99.06,68.58 SV3.9
PIO0B0
  Top 0.203: IC7.27 88.27,43.18 98.42,43.18 99.69,44.45 99.69,63.5 96.52,63.5 SV3.12
PIO0B1
  Bottom 0.203: IC7.28 90.81,50.8 90.81,57.15 92.08,58.42 92.08,63.5 94.61,66.04 97.79,66.04 SV3.11
PIO0B2  (via drill 0.3)
  Top 0.203: IC7.29 87.63,50.16 v92.71,50.16
  Bottom 0.203: v92.71,50.16 93.34,50.8 93.34,60.33 SV3.14
PIO0B3  (via drill 0.3)
  Top 0.203: IC7.30 87.63,52.7 v91.44,52.7
  Bottom 0.203: v91.44,52.7 92.71,53.98 92.71,61.59 94.61,63.5 97.79,63.5 SV3.13
PIO0B4  (via drill 0.3)
  Top 0.203: v91.44,59.05 92.08,59.69 SV3.16
  Bottom 0.203: v91.44,59.05 IC7.31
PIO0B5
  Top 0.203: IC7.32 88.27,55.88 95.89,55.88 96.52,56.52 96.52,59.69 SV3.15
PIO0B6
  Top 0.203: IC7.33 89.53,57.15 SV3.18
PIO0B7
  Top 0.203: IC7.34 87.63,61.59 93.98,61.59 94.61,60.96 98.42,60.96 99.06,60.33 99.06,57.15 SV3.17
PIO0BRDY
  Bottom 0.203: IC7.21 90.81,25.4 90.81,20.32 92.08,20.32 92.08,35.56 93.98,37.47 93.98,53.34 SV3.20
PIO0BSTB  (via drill 0.3)
  Top 0.203: IC7.17 72.39,37.47 85.09,37.47 85.72,38.1 v95.25,38.1
  Bottom 0.203: v95.25,38.1 96.52,38.1 96.52,53.34 SV3.19
PIO0IEO  (via drill 0.3)
  Top 0.203: v89.53,43.81 90.17,44.45 SV3.28
  Bottom 0.203: IC7.22 89.53,34.29 v89.53,43.81
RAM1  (via drill 0.3)
  Top 0.203: IC10.5 41.27,26.04 v44.45,26.04 | v45.72,35.56 46.99,36.83 60.33,36.83 62.87,39.37 v64.14,39.37 | IC3.20 v64.14,54.61
  Bottom 0.203: v44.45,26.04 45.72,27.3 v45.72,35.56 | v64.14,54.61 v64.14,39.37
RAM2  (via drill 0.3)
  Top 0.203: v38.1,51.44 40.01,53.34 98.42,53.34 99.06,52.7 99.06,50.8 97.16,50.8 95.89,49.53 SV3.24
  Bottom 0.203: IC10.6 38.1,25.4 v38.1,51.44
RAM3  (via drill 0.3)
  Top 0.203: IC10.7 46.99,13.97 v68.58,13.97 | v73.66,43.81 74.93,45.09 85.09,45.09 85.72,45.72 95.89,45.72 96.52,46.35 96.52,49.53 SV3.23
  Bottom 0.203: v68.58,13.97 70.48,15.88 70.48,22.86 73.66,26.04 v73.66,43.81
RD  (via drill 0.3)
  Top 0.203: IC8.1 4.45,22.86 4.45,27.94 5.08,27.94 | SV1.39 5.08,27.94 | IC1.21 27.3,28.57 14.61,28.57 13.97,27.94 5.08,27.94 | 50.8,24.13 IC4.6 | v29.84,24.13 50.8,24.13 | IC7.35 86.36,64.14 v83.19,64.14 | v74.93,27.3 71.75,24.13 50.8,24.13
  Bottom 0.203: v29.84,24.13 27.94,26.04 IC1.21 | v83.19,64.14 83.19,36.2 74.93,27.94 v74.93,27.3
RESET  (via drill 0.3)
  Top 0.203: 30.48,40.64 29.21,41.91 IC1.26 | 30.48,40.64 RN3.6 34.29,36.83 v43.18,36.83 | SV1.29 7.62,40.64 30.48,40.64 | v43.18,6.99 43.81,6.35 53.34,6.35 54.61,7.62 IC4.17
  Bottom 0.203: v43.18,6.99 T2.1 v43.18,36.83
RFSH
  Top 0.203: IC1.28 27.3,46.35 14.61,46.35 13.97,45.72 7.62,45.72 SV1.25
ROM0  (via drill 0.3)
  Top 0.203: v38.73,53.34 40.01,54.61 IC2.20
  Bottom 0.203: IC10.4 38.73,29.84 v38.73,53.34
SEL03  (via drill 0.3)
  Top 0.203: IC10.9 49.53,19.05 63.5,19.05 66.04,21.59 70.48,21.59 71.12,22.23 v99.69,22.23
  Bottom 0.203: v99.69,22.23 99.69,45.09 SV3.25
SIO0  (via drill 0.3)
  Top 0.203: v58.42,47.62 59.05,48.26 93.98,48.26 SV3.26
  Bottom 0.203: IC10.10 50.16,20.32 50.16,19.68 50.8,19.05 56.52,19.05 56.52,30.48 58.42,32.38 v58.42,47.62
TO0  (via drill 0.3)
  Top 0.203: v55.88,37.47 58.42,40.01 69.85,40.01 70.48,40.64 93.98,40.64 SV3.30
  Bottom 0.203: IC4.7 55.88,24.13 v55.88,37.47
TO1  (via drill 0.3)
  Top 0.203: v58.42,29.84 60.33,31.75 69.22,31.75 70.48,30.48 98.42,30.48 99.06,31.11 99.06,38.1 96.52,38.1 SV3.32
  Bottom 0.203: IC4.8 57.15,17.78 57.15,28.57 v58.42,29.84
TO2  (via drill 0.3)
  Top 0.203: IC4.9 53.34,16.51 v88.9,16.51
  Bottom 0.203: v88.9,16.51 92.71,20.32 92.71,34.29 SV3.34
TRG0
  Top 0.203: IC4.23 93.98,22.86 100.33,29.21 100.33,41.91 SV3.29
TRG1  (via drill 0.3)
  Top 0.203: v69.85,23.5 93.98,23.5 99.69,29.21 99.69,39.37 SV3.31
  Bottom 0.203: IC4.22 69.85,22.86 v69.85,23.5
TRG2  (via drill 0.3)
  Top 0.203: IC4.21 68.58,19.05 v94.61,19.05
  Bottom 0.203: v94.61,19.05 96.52,20.95 96.52,35.56 SV3.33
TRG3
  Top 0.203: SV5.2 IC4.20
VCC  (via drill 0.3)
  Top 0.203: C13.1 SV4.1 | IC2.1 IC2.28 IC3.1 IC3.28 | IC4.24 67.94,26.04 C1.1 | C15.1 IC7.26 85.72,43.18 70.48,43.18 69.22,41.91 69.22,40.64 v64.77,40.64 55.24,40.64 53.34,38.73 C18.1 | IC1.11 C12.1 8.89,53.34 5.08,53.34 SV1.22 | 7.62,23.5 IC8.14 11.43,27.3 33.66,27.3 | C16.1 7.62,23.5 | 10.79,13.97 IC9.13 13.97,15.88 15.24,15.88 IC9.11 | 10.79,13.97 IC9.14 6.35,13.97 C17.1 | 7.62,23.5 10.79,20.32 10.79,13.97 | R6.2 R1.2 41.91,3.17 46.99,3.17 R2.2 | 33.66,27.3 35.56,29.21 41.91,29.21 IC10.16 | 33.66,27.3 RN3.1
  Bottom 0.203: IC2.1 30.48,76.83 SV2.1 | IC2.26 45.72,71.75 45.72,74.93 | C13.1 45.72,74.93 | 45.72,74.93 IC2.28 | 65.41,71.75 IC3.26 | 65.41,71.75 65.41,73.03 IC3.28 67.31,78.11 C14.1 | IC4.24 64.77,27.94 v64.77,40.64 64.77,43.18 65.41,43.81 65.41,71.75 | 84.45,12.7 85.09,12.06 85.09,5.08 | SV6.1 85.09,5.08 | SV3.21 100.33,49.53 100.33,20.32 85.09,5.08 | C15.1 90.17,40.64 90.17,32.38 88.27,30.48 84.45,30.48 84.45,12.7 | 84.45,12.7 C4.+ | C12.1 8.89,50.8 8.89,26.04 IC8.14 | C18.1 48.26,37.47 IC10.16 | R6.2 38.73,3.81 38.73,21.59 37.47,22.86 33.66,22.86 33.66,22.23 32.38,22.23 RN3.1
WAIT
  Top 0.203: SV1.33 7.62,35.56 25.4,35.56 26.67,36.83 IC1.24
  Bottom 0.203: IC1.24 29.21,38.1 30.48,38.1 30.48,35.56 RN3.4
WR
  Top 0.203: SV1.37 7.62,30.48 26.67,30.48 IC1.22
  Bottom 0.203: IC8.10 21.59,27.3 21.59,32.38 24.13,34.92 26.04,34.92 26.04,33.66 IC1.22

### Text on the board
tNames: ROM/RAM | ROM/RAM | Z80 ESV1.0 | EXT | CLK